# Altium schematic sheet TypeC_USB2.0.SchDoc
size A3; SheetNumber: 5; SheetTotal: 16
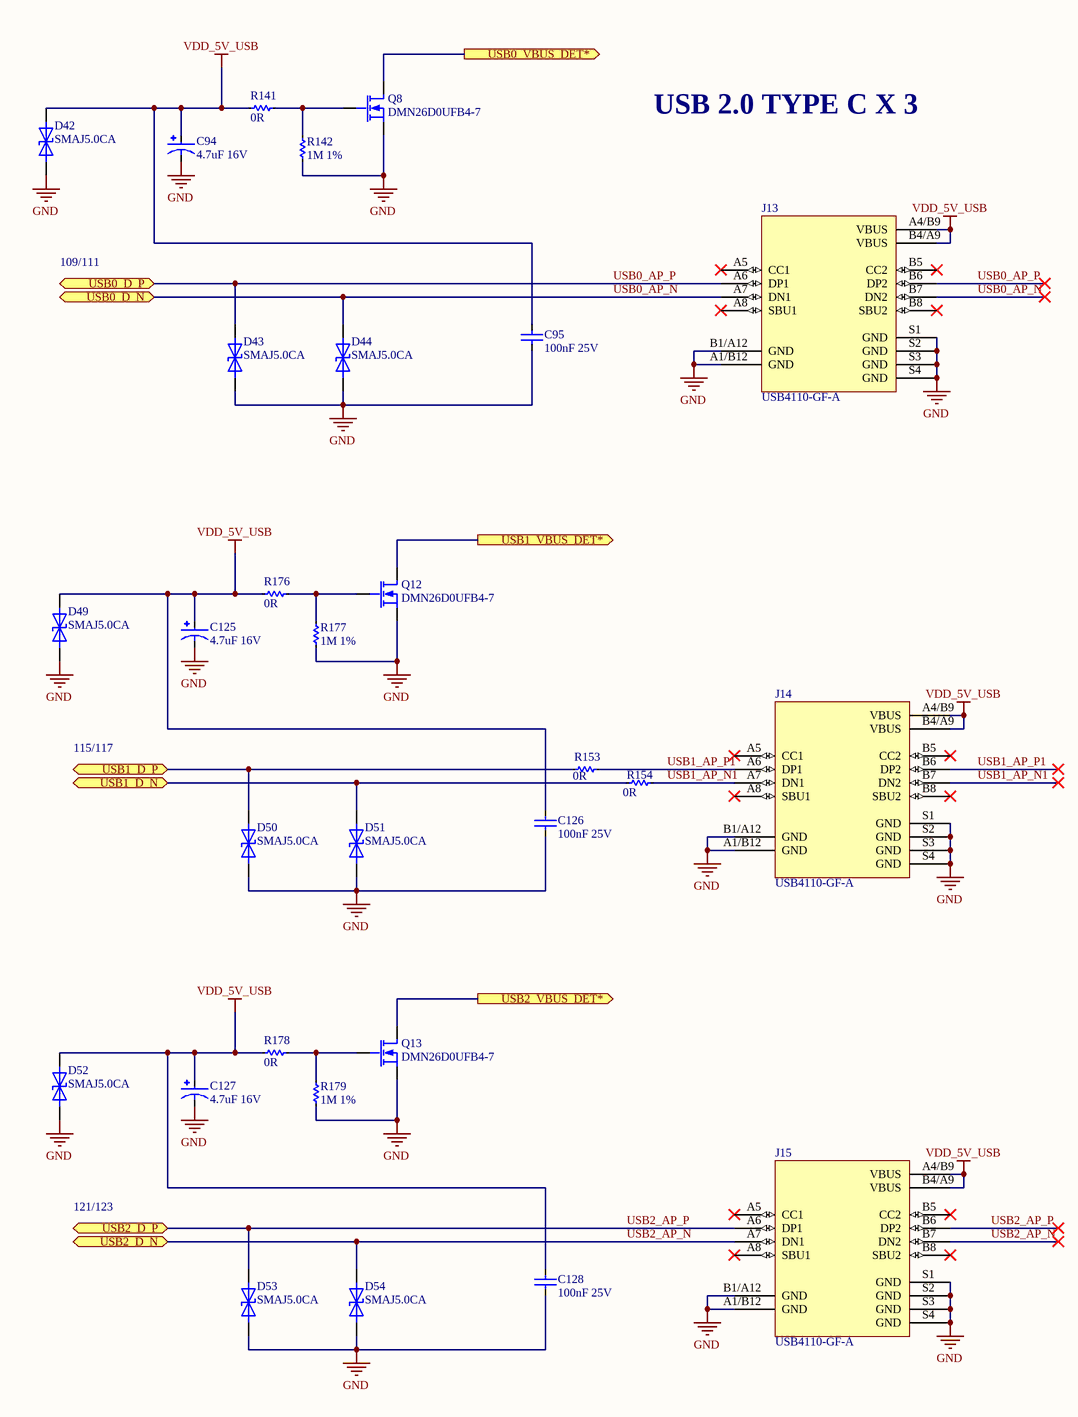
[diagram p0: TypeC_USB2.0.SchDoc]

## Parts
C94  4.7uF 16V  [C1206_TANTALUM]
C95  100nF 25V  [C0402]
C125  4.7uF 16V  [C1206_TANTALUM]
C126  100nF 25V  [C0402]
C127  4.7uF 16V  [C1206_TANTALUM]
C128  100nF 25V  [C0402]
D42  SMAJ5.0CA  [DO-214AC]
D43  SMAJ5.0CA  [DO-214AC]
D44  SMAJ5.0CA  [DO-214AC]
D49  SMAJ5.0CA  [DO-214AC]
D50  SMAJ5.0CA  [DO-214AC]
D51  SMAJ5.0CA  [DO-214AC]
D52  SMAJ5.0CA  [DO-214AC]
D53  SMAJ5.0CA  [DO-214AC]
D54  SMAJ5.0CA  [DO-214AC]
J13  USB4110-GF-A  [USB4110-GF-A]
J14  USB4110-GF-A  [USB4110-GF-A]
J15  USB4110-GF-A  [USB4110-GF-A]
Q8  DMN26D0UFB4-7  [DFN1006-3]
Q12  DMN26D0UFB4-7  [DFN1006-3]
Q13  DMN26D0UFB4-7  [DFN1006-3]
R141  0R  [R0603]
R142  1M 1%  [R0402]
R153  0R  [R0402]
R154  0R  [R0402]
R176  0R  [R0603]
R177  1M 1%  [R0402]
R178  0R  [R0603]
R179  1M 1%  [R0402]

## Ports
USB0_D_N (bidir), USB0_D_P (bidir), USB0_VBUS_DET* (out), USB1_D_N (bidir), USB1_D_P (bidir), USB1_VBUS_DET* (out), USB2_D_N (bidir), USB2_D_P (bidir), USB2_VBUS_DET* (out)

## Nets
GND: C94.2(-) C95.1 C125.2(-) C126.1 C127.2(-) C128.1 D42.C D43.C D44.C D49.C D50.C D51.C D52.C D53.C D54.C J13.A1/B12(GND) J13.B1/A12(GND) J13.S1(GND) J13.S2(GND) J13.S3(GND) J13.S4(GND) J14.A1/B12(GND) J14.B1/A12(GND) J14.S1(GND) J14.S2(GND) J14.S3(GND) J14.S4(GND) J15.A1/B12(GND) J15.B1/A12(GND) J15.S1(GND) J15.S2(GND) J15.S3(GND) J15.S4(GND) Q8.2(S) Q12.2(S) Q13.2(S) R142.1 R177.1 R179.1
VDD_5V_USB: C94.1(+1) C95.2 C125.1(+1) C126.2 C127.1(+1) C128.2 D42.A D49.A D52.A J13.A4/B9(VBUS) J13.B4/A9(VBUS) J14.A4/B9(VBUS) J14.B4/A9(VBUS) J15.A4/B9(VBUS) J15.B4/A9(VBUS) R141.1 R176.1 R178.1
USB0_AP_N: D44.A J13.A7(DN1) J13.B7(DN2) ; port USB0_D_N
USB0_AP_P: D43.A J13.A6(DP1) J13.B6(DP2) ; port USB0_D_P
USB0_VBUS_DET*: Q8.3(D) ; port USB0_VBUS_DET*
USB1_AP_N1: J14.A7(DN1) J14.B7(DN2) R154.2
USB1_AP_P1: J14.A6(DP1) J14.B6(DP2) R153.2
USB1_D_N: D51.A R154.1 ; port USB1_D_N
USB1_D_P: D50.A R153.1 ; port USB1_D_P
USB1_VBUS_DET*: Q12.3(D) ; port USB1_VBUS_DET*
USB2_AP_N: D54.A J15.A7(DN1) J15.B7(DN2) ; port USB2_D_N
USB2_AP_P: D53.A J15.A6(DP1) J15.B6(DP2) ; port USB2_D_P
USB2_VBUS_DET*: Q13.3(D) ; port USB2_VBUS_DET*
NetQ8_1: Q8.1(G) R141.2 R142.2
NetQ12_1: Q12.1(G) R176.2 R177.2
NetQ13_1: Q13.1(G) R178.2 R179.2

Not connected (* = marked no-connect by the designer): J13 A5(CC1)* A8(SBU1)* B5(CC2)* B8(SBU2)*; J14 A5(CC1)* A8(SBU1)* B5(CC2)* B8(SBU2)*; J15 A5(CC1)* A8(SBU1)* B5(CC2)* B8(SBU2)*

## Notes on the sheet
- USB 2.0 TYPE C X 3
- 109/111
- 115/117
- 121/123

## Library data of the parts
C94 C125 C127 = TAJA475K016RNJ: Cap Tant Solid 4.7uF 16V A CASE 10%( 3.2 X 1.6 X 1.6mm) Inward L SMD 3216-18 4 Ohm 125C T/R; Manufacturer: Kyocera AVX; Dielectric Material: Tantalum; ESR (Equivalent Series Resistance): 4R; Leakage Current: 800nA; Polarity: Polar; Dissipation Factor: 6%; Supplier 1: Digi-Key; Manufacturer Part Number: TAJA475K016RNJ; RoHS: Yes; Category: Tantalum Capacitors; Stock 1: 746000; Pricing 1: 2000=0.09306, 4000=0.08789, 10000=0.08272, 14000=0.08014, 50000=0.07238, 100000=0.06721 (USD); Mount: Surface Mount,PCB; Case/Package: 1206; Number of Pins: 2; Case Code (Metric): 3216; Case Code (Imperial): 1206; Min Operating Temperature: -55°C; Max Operating Temperature: 125°C; Package Quantity: 2000; Capacitance: 4.7uF; Voltage Rating: 16V; Tolerance: 10%; Packaging: Tape and Reel; Voltage Rating (DC): 16V; Termination: SMD/SMT; Voltage: 16V; Features: General Purpose; Series: TAJ; Construction: Flat; Length: 3.2mm; Width: 1.6mm; Height: 1.6mm; Height - Seated (Max): 0.071inch; Depth: 1.6mm; Lead Pitch: 1.1mm; Radiation Hardening: No; Reach SVHC Compliant: Yes; Lead Free: Lead Free; RoHS Compliant: Yes; ComponentLink1URL: https://datasheet.ciiva.com/18710/taj-eng-18710646.pdf?src-supplier=Distrelec; ComponentLink1Description: https://datasheet.ciiva.com/18710/taj-eng-18710646.pdf?src-supplier=Distrelec; ComponentLink2URL: https://datasheet.ciiva.com/7914/taj-7914556.pdf?src-supplier=Element14; ComponentLink2Description: https://datasheet.ciiva.com/7914/taj-7914556.pdf?src-supplier=Element14; ComponentLink3URL: https://datasheet.ciiva.com/7914/taj-7914558.pdf?src-supplier=Element14; ComponentLink3Description: https://datasheet.ciiva.com/7914/taj-7914558.pdf?src-supplier=Element14; ComponentLink4URL: https://datasheet.ciiva.com/7914/1680476-7914555.pdf?src-supplier=Element14; ComponentLink4Description: https://datasheet.ciiva.com/7914/1680476-7914555.pdf?src-supplier=Element14; ComponentLink5URL: https://datasheet.ciiva.com/5934/13070-5934925.pdf?src-supplier=Farnell; ComponentLink5Description: https://datasheet.ciiva.com/5934/13070-5934925.pdf?src-supplier=Farnell; ComponentLink6URL: https://datasheet.ciiva.com/7914/13070-7914557.pdf?src-supplier=Element14; ComponentLink6Description: https://datasheet.ciiva.com/7914/13070-7914557.pdf?src-supplier=Element14; ComponentLink7URL: https://datasheet.ciiva.com/263/taj-263377.pdf?src-supplier=Digi-Key; ComponentLink7Description: https://datasheet.ciiva.com/263/taj-263377.pdf?src-supplier=Digi-Key; ComponentLink8URL: https://datasheet.ciiva.com/263/taj-263376.pdf?src-supplier=Digi-Key; ComponentLink8Description: https://datasheet.ciiva.com/263/taj-263376.pdf?src-supplier=Digi-Key; ComponentLink9URL: https://datasheet.ciiva.com/263/taj-263378.pdf?src-supplier=Digi-Key; ComponentLink9Description: https://datasheet.ciiva.com/263/taj-263378.pdf?src-supplier=Digi-Key; Supplier Part Number 1: 478-3868-2-ND
C95 C126 C128 = 04023C104KAT2A: 0402 100 nF 25 V ±10 % Tolerance X7R Surface Mount Multilayer Ceramic Capacitor; Manufacturer: Kyocera AVX; Tolerance: 10%; Supplier 1: Digi-Key; Manufacturer Part Number: 04023C104KAT2A; RoHS: Yes; Category: Ceramic Capacitors; Stock 1: 3248475; Pricing 1: 1=0.10000, 10=0.03300, 50=0.01820, 100=0.01480, 500=0.01060, 1000=0.00833, 2500=0.00758, 5000=0.00697 (USD); Mount: Surface Mount; Case/Package: 0402; Number of Pins: 2; Case Code (Metric): 1005; Case Code (Imperial): 0402; Min Operating Temperature: -55°C; Max Operating Temperature: 125°C; Capacitance: 100nF; Packaging: Cut Tape; Dielectric: X7R; Voltage Rating (DC): 25V; Voltage Rating: 25V; Package Quantity: 1; Termination: SMD/SMT; Voltage: 25V; Series: -; Construction: Flat; Length: 1mm; Width: 1mm; Thickness: 0.022inch; Depth: 0.5mm; Radiation Hardening: No; Reach SVHC Compliant: Yes; Lead Free: Lead Free; RoHS Compliant: Yes; ComponentLink1URL: https://datasheet.ciiva.com/1123/1679506-1123344.pdf?src-supplier=Element14; ComponentLink1Description: https://datasheet.ciiva.com/1123/1679506-1123344.pdf?src-supplier=Element14; ComponentLink2URL: https://datasheet.ciiva.com/7614/cx7r-7614663.pdf?src-supplier=Digi-Key; ComponentLink2Description: https://datasheet.ciiva.com/7614/cx7r-7614663.pdf?src-supplier=Digi-Key; ComponentLink3URL: https://datasheet.ciiva.com/7709/1679506-7709527.pdf?src-supplier=Element14; ComponentLink3Description: https://datasheet.ciiva.com/7709/1679506-7709527.pdf?src-supplier=Element14; ComponentLink4URL: https://datasheet.ciiva.com/6265/cx7r-6265272.pdf?src-supplier=Digi-Key; ComponentLink4Description: https://datasheet.ciiva.com/6265/cx7r-6265272.pdf?src-supplier=Digi-Key; ComponentLink5URL: https://datasheet.ciiva.com/14906/cx7r-14906223.pdf?src-supplier=Digi-Key; ComponentLink5Description: https://datasheet.ciiva.com/14906/cx7r-14906223.pdf?src-supplier=Digi-Key; Supplier Part Number 1: 478-7868-1-ND
D42-D44 D49-D54 = SMAJ5.0CA: Transient Voltage Suppressor, TVS, SMAJ Series, Bidirectional, 5 V, DO-214AC, 2, 6.4 V RoHS Compliant: Yes; Manufacturer: Littelfuse; Reverse Breakdown Voltage: 6.4V; Operating Supply Voltage: 5V; Max Surge Current: 43.5A; Number of Elements: 1; Clamping Voltage: 9.2V; Peak Pulse Power: 400W; Power Line Protection: No; Test Current: 10mA; Max Reverse Leakage Current: 800uA; Max Breakdown Voltage: 7V; Max Power Dissipation: 3.3W; Element Configuration: Single; Leakage Current: 1.6mA; Capacitance: 1.05nF; Diode Type: ZENER; Supplier 1: Digi-Key; Manufacturer Part Number: SMAJ5.0CA; RoHS: Yes; Category: TVS Diodes; Stock 1: 526420; Pricing 1: 1=0.43000, 10=0.32000, 100=0.19950, 500=0.13650, 1000=0.10500, 2000=0.09450 (USD); Mount: Surface Mount; Case/Package: DO-214AC; Number of Pins: 2; Min Operating Temperature: -65°C; Max Operating Temperature: 150°C; Package Quantity: 5000; Direction: Bidirectional; Packaging: Tape and Reel; Number of Bidirectional Channels: 1; Reverse Standoff Voltage: 5V; Min Breakdown Voltage: 6.4V; Breakdown Voltage: 6.4V; Number of Channels: 1; Polarity: Bidirectional; Termination: SMD/SMT; Peak Pulse Current: 43.5A; Power Dissipation: 400W; Voltage Rating (DC): 5V; Max Output Current: 43.5A; Resistor Type: Zener; Series: SMAJ; Clamping Voltage-Max: 9.2V; Length: 4.5mm; Width: 2.79mm; Height: 2.087mm; Radiation Hardening: No; Reach SVHC Compliant: Yes; Lead Free: Lead Free; RoHS Compliant: Yes; ComponentLink1URL: https://datasheet.ciiva.com/25624/0900766b810f4edb-25624837.pdf?src-supplier=Rs; ComponentLink1Description: https://datasheet.ciiva.com/25624/0900766b810f4edb-25624837.pdf?src-supplier=Rs; ComponentLink2URL: https://datasheet.ciiva.com/28473/607617-28473438.pdf?src-supplier=Element14; ComponentLink2Description: https://datasheet.ciiva.com/28473/607617-28473438.pdf?src-supplier=Element14; ComponentLink3URL: https://datasheet.ciiva.com/16206/littelfuse-tvs-diode-smaj-16206104.pdf?src-supplier=Future+Electronics; ComponentLink3Description: https://datasheet.ciiva.com/16206/littelfuse-tvs-diode-smaj-16206104.pdf?src-supplier=Future+Electronics; ComponentLink4URL: https://datasheet.ciiva.com/331/littelfuse-tvs-diode-smaj-datasheet-pdf-331055.pdf?src-supplier=Digi-Key; ComponentLink4Description: https://datasheet.ciiva.com/331/littelfuse-tvs-diode-smaj-datasheet-pdf-331055.pdf?src-supplier=Digi-Key; ComponentLink5URL: https://datasheet.ciiva.com/331/littelfuse-tvs-diode-smaj-datasheet-pdf-331056.pdf?src-supplier=Digi-Key; ComponentLink5Description: https://datasheet.ciiva.com/331/littelfuse-tvs-diode-smaj-datasheet-pdf-331056.pdf?src-supplier=Digi-Key; ComponentLink6URL: https://datasheet.ciiva.com/331/littelfuse-tvs-diode-smaj-datasheet-pdf-331054.pdf?src-supplier=Digi-Key; ComponentLink6Description: https://datasheet.ciiva.com/331/littelfuse-tvs-diode-smaj-datasheet-pdf-331054.pdf?src-supplier=Digi-Key; Supplier Part Number 1: SMAJ5.0CALFCT-ND
J13-J15 = USB4110-GF-A: Conn USB 2.0 Type C RCP 16 POS 0.3mm/0.5mm Solder ST SMD 16 Terminal 1 Port T/R; Manufacturer: Global Connector Technology; Gender: Receptacle; Mating Cycles: 10000; Shielding: Shielded; Number of Ports: 1; Supplier 1: Farnell; Manufacturer Part Number: USB4110-GF-A; RoHS: No; Category: USB Connectors; Stock 1: 3190; Pricing 1: 1=1.17000, 10=1.04000, 25=0.97800, 50=0.93500, 100=0.89200, 250=0.82000, 500=0.74800 (GBP); Mount: Surface Mount,Through Hole,Horizontal; Contact Plating: Gold; Insulation Color: Black; Min Operating Temperature: -40°C; Max Operating Temperature: 85°C; Connector Type: USB; Series: USB4110; Termination: Solder; Flammability Rating: UL94 V-0; ComponentLink1URL: https://gct.co/files/drawings/usb4110.pdf?src-supplier=Digi-Key; ComponentLink1Description: https://gct.co/files/drawings/usb4110.pdf?src-supplier=Digi-Key; Supplier Part Number 1: 3583367
Q8 Q12 Q13 = DMN26D0UFB4-7: Single N-Channel 20 V 350 mW Silicon Surface Mount Mosfet - DFN-3; Manufacturer: Diodes; Rise Time: 7.9ns; Rds On Max: 3R; Input Capacitance: 14.1pF; Continuous Drain Current (ID): 240mA; Drain to Source Resistance: 1.8R; Power Dissipation: 350mW; Turn-Off Delay Time: 13.4ns; Drain to Source Voltage (Vdss): 20V; Turn-On Delay Time: 3.8ns; Fall Time: 15.2ns; Number of Elements: 1; Gate to Source Voltage (Vgs): 10V; On-State Resistance: 10R; FET Type: 1 N-Channel; Supplier 1: Mouser; Manufacturer Part Number: DMN26D0UFB4-7; RoHS: Yes; Category: MOSFETs; Stock 1: 21043; Pricing 1: 1=0.38000, 10=0.32100, 50=0.32100, 100=0.17000, 1000=0.07700, 10000=0.05000 (USD); Mount: Surface Mount; Case/Package: DFN; Number of Pins: 3; Min Operating Temperature: -55°C; Max Operating Temperature: 150°C; Packaging: Tape and Reel; Package Quantity: 3000; Max Power Dissipation: 350mW; Element Configuration: Single; Number of Channels: 1; Polarity: N-CHANNEL; Series: -; Drain-source On Resistance-Max: 10R; Length: 1.05mm; Width: 0.65mm; Height: 0.35mm; Radiation Hardening: No; Reach SVHC Compliant: Yes; Lead Free: Lead Free; RoHS Compliant: Yes; ComponentLink1URL: https://datasheet.ciiva.com/4443/ds31775-89139-4443083.pdf?src-supplier=Mouser; ComponentLink1Description: https://datasheet.ciiva.com/4443/ds31775-89139-4443083.pdf?src-supplier=Mouser; ComponentLink2URL: https://datasheet.ciiva.com/11176/ds31775-11176556.pdf?src-supplier=Avnet; ComponentLink2Description: https://datasheet.ciiva.com/11176/ds31775-11176556.pdf?src-supplier=Avnet; ComponentLink3URL: https://datasheet.ciiva.com/16434/ds31775-16434037.pdf?src-supplier=Future+Electronics; ComponentLink3Description: https://datasheet.ciiva.com/16434/ds31775-16434037.pdf?src-supplier=Future+Electronics; ComponentLink4URL: https://datasheet.ciiva.com/48532/ds31775-48532486.pdf?src-supplier=Avnet; ComponentLink4Description: https://datasheet.ciiva.com/48532/ds31775-48532486.pdf?src-supplier=Avnet; ComponentLink5URL: https://datasheet.ciiva.com/934/ds31775-934573.pdf?src-supplier=Digi-Key; ComponentLink5Description: https://datasheet.ciiva.com/934/ds31775-934573.pdf?src-supplier=Digi-Key; ComponentLink6URL: https://datasheet.ciiva.com/934/ds31775-934574.pdf?src-supplier=Digi-Key; ComponentLink6Description: https://datasheet.ciiva.com/934/ds31775-934574.pdf?src-supplier=Digi-Key; ComponentLink7URL: https://datasheet.ciiva.com/934/ds31775-934572.pdf?src-supplier=Digi-Key; ComponentLink7Description: https://datasheet.ciiva.com/934/ds31775-934572.pdf?src-supplier=Digi-Key; Supplier Part Number 1: 621-DMN26D0UFB4-7
R141 R176 R178 = CR0603-J/-000ELF: RES SMD 0 OHM JUMPER 1/10W 0603; Manufacturer: Bourns; Resistance: 0mR; Power Rating: 100mW; Tolerance: 1%; Voltage Rating: 50V; Temperature Coefficient: 500ppm/°C; Resistance Tolerance: 5%; Supplier 1: Digi-Key; Manufacturer Part Number: CR0603-J/-000ELF; RoHS: Yes; Category: Chip SMD Resistors; Stock 1: 1690954; Pricing 1: 1=0.10000, 10=0.01300, 25=0.00960, 50=0.00720, 100=0.00540, 250=0.00408, 500=0.00328, 1000=0.00241 (USD); Mount: Surface Mount; Case/Package: 0603; Number of Pins: 2; Case Code (Imperial): 0603; Case Code (Metric): 1608; Contact Plating: Tin; Min Operating Temperature: -55°C; Max Operating Temperature: 155°C; Packaging: Tape and Reel; Package Quantity: 5000; Resistor Type: Thick Film; Termination: SMD/SMT; Max Power Dissipation: 100mW; Voltage Rating (DC): 50V; Series: CR0603; Technology: THICK FILM; Construction: Rectangular; Features: Moisture Resistant; Number of Terminations: 2; Length: 1.6mm; Width: 0.8mm; Height: 0.45mm; Depth: 0.8mm; Thickness: 457um; Radiation Hardening: No; Reach SVHC Compliant: Yes; Military Standard: Not; RoHS Compliant: Yes; ComponentLink1URL: https://datasheet.ciiva.com/11809/0900766b80fcdb72-11809586.pdf?src-supplier=RSComponents; ComponentLink1Description: https://datasheet.ciiva.com/11809/0900766b80fcdb72-11809586.pdf?src-supplier=RSComponents; ComponentLink2URL: https://datasheet.ciiva.com/7001/1902866-7001645.pdf?src-supplier=Newark; ComponentLink2Description: https://datasheet.ciiva.com/7001/1902866-7001645.pdf?src-supplier=Newark; ComponentLink3URL: https://datasheet.ciiva.com/7986/691949-7986171.pdf?src-supplier=Element14; ComponentLink3Description: https://datasheet.ciiva.com/7986/691949-7986171.pdf?src-supplier=Element14; ComponentLink4URL: https://datasheet.ciiva.com/7660/1856384-7660956.pdf?src-supplier=Element14; ComponentLink4Description: https://datasheet.ciiva.com/7660/1856384-7660956.pdf?src-supplier=Element14; ComponentLink5URL: https://datasheet.ciiva.com/22693/1902866-22693213.pdf?src-supplier=Element14; ComponentLink5Description: https://datasheet.ciiva.com/22693/1902866-22693213.pdf?src-supplier=Element14; ComponentLink6URL: https://datasheet.ciiva.com/5545/chpreztr-5545708.pdf?src-supplier=Mouser; ComponentLink6Description: https://datasheet.ciiva.com/5545/chpreztr-5545708.pdf?src-supplier=Mouser; ComponentLink7URL: https://datasheet.ciiva.com/16761/70154685-16761515.pdf?src-supplier=Allied+Electronics; ComponentLink7Description: https://datasheet.ciiva.com/16761/70154685-16761515.pdf?src-supplier=Allied+Electronics; ComponentLink8URL: https://datasheet.ciiva.com/30062/159chpreztr-30062601.pdf?src-supplier=Onlinecomponents.com; ComponentLink8Description: https://datasheet.ciiva.com/30062/159chpreztr-30062601.pdf?src-supplier=Onlinecomponents.com; ComponentLink9URL: https://datasheet.ciiva.com/48692/001055497-da-01-en-smd-wid-cr0603-j-000elf-0-0-ohm-1-10w-48692135.pdf?src-supplier=Conrad; ComponentLink9Description: https://datasheet.ciiva.com/48692/001055497-da-01-en-smd-wid-cr0603-j-000elf-0-0-ohm-1-10w-48692135.pdf?src-supplier=Conrad; Supplier Part Number 1: CR0603-J/-000ELFCT-ND
R142 R177 R179 = AC0402FR-071ML: RES SMD 1M OHM 1% 1/16W 0402; Manufacturer: Yageo; Power Rating: 62.5mW; Resistance: 1MR; Voltage Rating: 50V; Temperature Coefficient: 100ppm/°C; Max Power Dissipation: 63mW; Supplier 1: Digi-Key; Manufacturer Part Number: AC0402FR-071ML; RoHS: Yes; Category: Chip SMD Resistors; Stock 1: 684587; Pricing 1: 1=0.10000, 10=0.01900, 100=0.00790, 1000=0.00353, 2500=0.00307, 5000=0.00253 (USD); Case/Package: 0402; Case Code (Imperial): 0402; Case Code (Metric): 1005; Size Code: 0402; Min Operating Temperature: -55°C; Max Operating Temperature: 155°C; Packaging: Tape and Reel; Tolerance: 1%; Termination: SMD/SMT; Resistor Type: Thick Film; Number of Terminations: 2; Features: Moisture Resistant,Automotive AEC-Q200; Series: AC; Construction: Rectangular; Length: 1mm; Width: 0.5mm; Height: 0.015inch; Depth: 0.5mm; Military Standard: Not; Lead Free: Lead Free; RoHS Compliant: Yes; ComponentLink1URL: http://www.yageo.com/documents/recent/PYu-AC_51_RoHS_L_2.pdf?src-supplier=Mouser; ComponentLink1Description: http://www.yageo.com/documents/recent/PYu-AC_51_RoHS_L_2.pdf?src-supplier=Mouser; ComponentLink2URL: http://www.yageo.com/documents/recent/PYu-AC_51_RoHS_L_2_revised.pdf?src-supplier=Future+Electronics; ComponentLink2Description: http://www.yageo.com/documents/recent/PYu-AC_51_RoHS_L_2_revised.pdf?src-supplier=Future+Electronics; ComponentLink3URL: http://www.yageo.com/NewPortal/yageodocoutput?fileName=/pdf/R-Chip/PYu-AC_51_RoHS_L_6.pdf&src-supplier=Digi-Key; ComponentLink3Description: http://www.yageo.com/NewPortal/yageodocoutput?fileName=/pdf/R-Chip/PYu-AC_51_RoHS_L_6.pdf&src-supplier=Digi-Key; Supplier Part Number 1: YAG3450CT-ND
R153 R154 = RC0402JR-070RP: Res Jumper Thick Film 0402 0 Ohm 5% 1/16W Molded SMD Paper T/R; Manufacturer: Yageo; Resistance: 0mR; Max Power Dissipation: 63mW; Supplier 1: Digi-Key; Manufacturer Part Number: RC0402JR-070RP; RoHS: Yes; Category: Chip SMD Resistors; Stock 1: 5886851; Pricing 1: 1=0.10000, 10=0.02300, 25=0.01640, 50=0.01240, 100=0.00920, 250=0.00700, 500=0.00560, 1000=0.00412, 5000=0.00296 (USD); Case/Package: 0402; Case Code (Metric): 1005; Case Code (Imperial): 0402; Min Operating Temperature: -55°C; Max Operating Temperature: 155°C; Packaging: Tape and Reel; Resistor Type: Thick Film; Number of Terminations: 2; Features: Moisture Resistant; Length: 0.039inch; Width: 0.02inch; Height: 0.016inch; RoHS Compliant: Yes; ComponentLink1URL: http://www.yageo.com/NewPortal/yageodocoutput?fileName=/pdf/R-Chip/PYu-RC_51_RoHS_P_0.pdf&src-supplier=Digi-Key; ComponentLink1Description: http://www.yageo.com/NewPortal/yageodocoutput?fileName=/pdf/R-Chip/PYu-RC_51_RoHS_P_0.pdf&src-supplier=Digi-Key; Supplier Part Number 1: YAG1279CT-ND